# Altium schematic sheet ALL COMPONENTS.SchDoc
size A; SheetNumber: 5; SheetTotal: 6
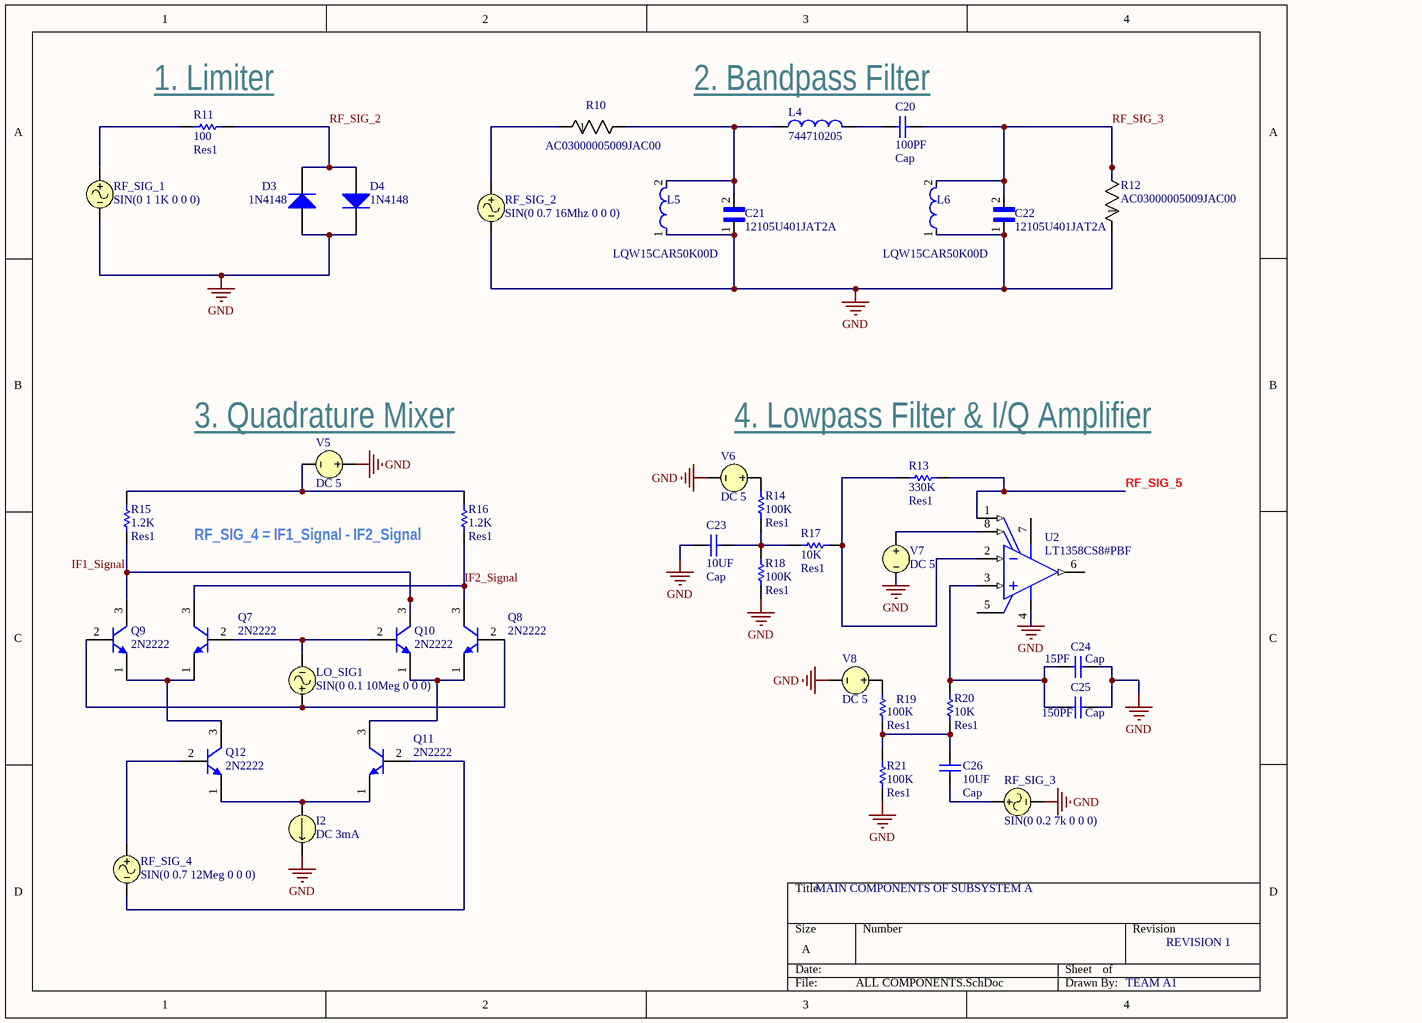
[diagram p0: ALL COMPONENTS.SchDoc]

## Parts
C20  Cap  value 100PF  [RADIAL-0.1]
C21  12105U401JAT2A  [CAPC3224X140N]
C22  12105U401JAT2A  [CAPC3224X140N]
C23  Cap  value 10UF  [RADIAL-0.1]
C24  Cap  value 15PF  [RADIAL-0.1]
C25  Cap  value 150PF  [RADIAL-0.1]
C26  Cap  value 10UF  [RADIAL-0.1]
D3  1N4148  [NXP-SOD27-2_V]
D4  1N4148  [NXP-SOD27-2_V]
I2  DC 3mA
L4  744710205  [744710205]
L5  LQW15CAR50K00D  [FP-LQW15CA_00-MFG]
L6  LQW15CAR50K00D  [FP-LQW15CA_00-MFG]
LO_SIG1  SIN(0 0.1 10Meg 0 0 0)
Q7  2N2222  [MLTC-TO-18-3]
Q8  2N2222  [MLTC-TO-18-3]
Q9  2N2222  [MLTC-TO-18-3]
Q10  2N2222  [MLTC-TO-18-3]
Q11  2N2222  [MLTC-TO-18-3]
Q12  2N2222  [MLTC-TO-18-3]
R10  AC03000005009JAC00  [RES_AC03_VIS]
R11  Res1  value 100  [AXIAL-0.1-RES]
R12  AC03000005009JAC00  [RES_AC03_VIS]
R13  Res1  value 330K  [AXIAL-0.1-RES]
R14  Res1  value 100K  [AXIAL-0.1-RES]
R15  Res1  value 1.2K  [AXIAL-0.1-RES]
R16  Res1  value 1.2K  [AXIAL-0.1-RES]
R17  Res1  value 10K  [AXIAL-0.1-RES]
R18  Res1  value 100K  [AXIAL-0.1-RES]
R19  Res1  value 100K  [AXIAL-0.1-RES]
R20  Res1  value 10K  [AXIAL-0.1-RES]
R21  Res1  value 100K  [AXIAL-0.1-RES]
RF_SIG_1  SIN(0 1 1K 0 0 0)
RF_SIG_2  SIN(0 0.7 16Mhz 0 0 0)
RF_SIG_3  SIN(0 0.2 7k 0 0 0)
RF_SIG_4  SIN(0 0.7 12Meg 0 0 0)
U2  LT1358CS8#PBF  [LT-S8-8_M]
V5  DC 5
V6  DC 5
V7  DC 5
V8  DC 5

## Nets
GND: C21.1 C22.1 C23.1 C24.2 C25.1 D3.1(A) D4.2(K) I2.2 L5.1 L6.1 R12.1 R18.1 R21.1 RF_SIG_1.2 RF_SIG_2.2 RF_SIG_3.2 U2.4(V-) V5.1 V6.2 V7.2 V8.2
IF1_Signal: Q9.3(C) Q10.3(C) R15.1
IF2_Signal: Q7.3(C) Q8.3(C) R16.1
RF_SIG_2: D3.2(K) D4.1(A) R11.2
RF_SIG_3: C20.2 C22.2 L6.2 R12.2
RF_SIG_5: R13.2 U2.1(NULL)
NetC20_1: C20.1 L4.2
NetC21_2: C21.2 L4.1 L5.2 R10.2
NetC23_2: C23.2 R14.1 R17.1 R18.2
NetC24_1: C24.1 C25.2 R20.2 U2.3(+IN)
NetC26_1: C26.1 RF_SIG_3.1
NetC26_2: C26.2 R19.1 R20.1 R21.2
NetI2_1: I2.1 Q11.1(E) Q12.1(E)
NetLO_SIG1_1: LO_SIG1.1 Q8.2(B) Q9.2(B)
NetLO_SIG1_2: LO_SIG1.2 Q7.2(B) Q10.2(B)
NetQ7_1: Q7.1(E) Q9.1(E) Q12.3(C)
NetQ8_1: Q8.1(E) Q10.1(E) Q11.3(C)
NetQ11_2: Q11.2(B) RF_SIG_4.2
NetQ12_2: Q12.2(B) RF_SIG_4.1
NetR10_1: R10.1 RF_SIG_2.1
NetR11_1: R11.1 RF_SIG_1.1
NetR13_1: R13.1 R17.2 U2.2(-IN)
NetR14_2: R14.2 V6.1
NetR15_2: R15.2 R16.2 V5.2
NetR19_2: R19.2 V8.1
NetU2_8: U2.8(NULL) V7.1

Not connected (* = marked no-connect by the designer): U2 5(NC) 6(VOUT) 7(V+)

## Notes on the sheet
- (near R11) 1. Limiter
- 2. Bandpass Filter
- (near V5) 3. Quadrature Mixer
- 4. Lowpass Filter & I/Q Amplifier
- (near R16) RF_SIG_4 = IF1_Signal - IF2_Signal
- MAIN COMPONENTS OF SUBSYSTEM A
- REVISION 1
- TEAM A1

## Library data of the parts
C20 = CAP CER 100PF 50V C0G/NP0 RADIAL: Capacitor; Manufacturer Part Number: K101K15C0GF53L2; Designator: C?; Voltage Rating: 50V; Published: 8-Jun-2000; LatestRevisionDate: 17-Jul-2002; LatestRevisionNote: Re-released for DXP Platform.; Publisher: Altium Limited
C21 C22 = 12105U401JAT2A: CAP CER 400PF 50V 5% NP0 1210; Package: None; Price: None; Value: *; MP: 12105U401JAT2A; Availability: Unavailable
C23 C26 = CAP ALUM 10UF 20% 63V RADIAL: Capacitor; Manufacturer Part Number: ESK106M063AC3FA; Designator: C?; Voltage Rating: 63V; Published: 8-Jun-2000; LatestRevisionDate: 17-Jul-2002; LatestRevisionNote: Re-released for DXP Platform.; Publisher: Altium Limited
C24 = CAP CER 15PF 50V C0G/NP0 RADIAL: Capacitor; Manufacturer Part Number: K150J15C0GF5TL2; Designator: C?; Voltage Rating: 50V; Published: 8-Jun-2000; LatestRevisionDate: 17-Jul-2002; LatestRevisionNote: Re-released for DXP Platform.; Publisher: Altium Limited
C25 = CAP CER 150PF 50V C0G/NP0 RADIAL: Capacitor; Manufacturer Part Number: K151J15C0GF53L2; Designator: C?; Voltage Rating: 50V; Published: 8-Jun-2000; LatestRevisionDate: 17-Jul-2002; LatestRevisionNote: Re-released for DXP Platform.; Publisher: Altium Limited
D3 D4 = CMP-0648-00002-1: High-speed Diode, 100 V, 450 mA, 2-Pin SOD27, RoHS; Manufacturer: NXP Semiconductors; Configuration: Single; IR (VR: 20 V)=25 nA; IFRM: 450 mA; IFSM: 4 A Max.; Trr: 4 ns Max.; Cd: 4 pF Max.; VR: 100 V Max.; VF (IF: 10 mA)=1 V; IF: 200 mA Max.; ComponentLink1Description: Manufacturer URL; RoHS: TRUE; ComponentLink1URL: http://www.nxp.com/; ComponentLink3Description: Package Specification; DatasheetVersion: Aug-04; ComponentLink2Description: Datasheet; PackageVersion: Aug-04; PackageReference: SOD27; ComponentLink3URL: http://www.nxp.com/documents/data_sheet/1N4148_1N4448.pdf; Mounting Technology: Through Hole; ComponentLink2URL: http://www.nxp.com/documents/data_sheet/1N4148_1N4448.pdf; PartNumber: 1N4148; PackageDescription: 2-Pin Hermetically Sealed Glass Package, Axial Leaded, Dia 1.85 mm, Body Length 4.25 mm, Lead Spread 25.4 mm
I2 = ISRC: Current Source; Note: PCB Footprint - Not required; AC Magnitude: 0; Published: 8-Jun-2000; LatestRevisionDate: 17-Jul-2002; LatestRevisionNote: Re-released for DXP Platform.; PackageReference: Not Applicable; Publisher: Altium Limited; AC Phase: 0; Value: 3mA
L4 = CMP-0221-00023-2: NexarPartId: 8917044; Lead Length: 9.7mm; Current Rating: 5A; Shielding: Unshielded; Core Material: Ferrite; Frequency: 100MHz; Pin Length: 3mm; Test Frequency: 10kHz; Tolerance: 25%; Resistance: 6.5MΩ; Inductance: 2µH; RoHS: Compliant; Composition: Wirewound; Ambient Temperature Range Low: -40°C; Termination: Radial; Ambient Temperature Range High: 110°C; REACH SVHC: Unknown; Width: 9.6mm; Height: 14mm; Number of Pins: 2; Length: 14mm; Lead Pitch: 9.6mm; Max Operating Temperature: 150°C; Inductance Tolerance: 25%; Mount: Through Hole; Case/Package: Radial; Max DC Current: 5A; Diameter: 4mm; Min Operating Temperature: -40°C; DC Resistance (DCR): 6.5mΩ; Self Resonant Frequency: 100MHz
L5 L6 = CMP-06042-016137-1: Wire Wound Ferrite Inductor for General Circuits 500nH ±10% 270mA 0.97Ω 0402 (1005); DC Resistance (DCR): 970mR; Test Frequency: 10MHz; Shielding: Unshielded; Self Resonant Frequency: 900MHz; RoHS Compliant: Yes; Case/Package: Nonstandard; Resistor Type: Wirewound; Height - Seated (Max): 0.026inch; Current Rating: 270mA; Width: 0.022inch; Tolerance: 10%; Min Operating Temperature: -40°C; Mount: Surface Mount; Packaging: Tape and Reel; Length: 0.04inch; Inductance: 500nH; Max Operating Temperature: 125°C; Core Material: Ferrite
LO_SIG1 = VSIN: Sinusoidal Voltage Source; Note: PCB Footprint - Not required; Offset: 0; Amplitude: 0.1; Published: 8-Jun-2000; LatestRevisionDate: 15-Nov-2004; LatestRevisionNote: Corrected Netlist.; PackageReference: Not Applicable; Publisher: Altium Limited; Frequency: 10Meg; Delay: 0; Damping Factor: 0; Phase: 0; DC Magnitude: 0; AC Magnitude: 0; AC Phase: 0
Q7-Q12 = CMP-2000-05237-1: Low Power Bipolar NPN Transistor, 30 V, -65 to 200 degC, 3-Pin TO-18, RoHS, Bulk; Manufacturer: Multicomp; Pin Configuration: a; No. of Pins: 3; No. of Transistors: 1; Collector Emitter Voltage Vces: 400mV; Current Ic Continuous a Max: 800mA; Power Dissipation Pd: 500mW; Collector Emitter Voltage V(br)ceo: 30V; Gain Bandwidth ft Typ: 250MHz; Voltage Vcbo: 60V; DC Current Gain hFE: 100; Full Power Rating Temperature: 25degC; Current Ic @ Vce Sat: 150mA; SVHC: NoSVHC(19-Dec-2012); Package Reference: TO-18-3; Package Description: 3-Pin Transistor Outline Package (TO-18), Dia 5.54 mm, Pitch Pitch 1.485mm; Datasheet URL: http://www.farnell.com/datasheets/1662272.pdf; Transistor Case Style: TO-18; Continuous Collector Current Ic Max: 800mA; Manufacturer URL: http://uk.farnell.com/b/multicomp; DC Collector Current: 800mA; Hfe Min: 100; Transistor Polarity: NPN; Power Dissipation Ptot Max: 500mW; Package / Case: TO-18; Datasheet Version: Rev. 1.1, 05/2012; Gain Bandwidth ft Min: 250MHz; Current Ic hFE: 150mA
R10 R12 = CMP-00030-39746332-1: AC03000005009JAC00 Res Wirewound 50 Ohm 5% 3W -80ppm/°C to -10ppm/°C Conformal AXL Thru-Hole Ammo Pack; Voltage Rating: 12V; Lead Diameter: 800µm; Resistance: 50Ω; Number of Terminations: 2; Features: Flame Retardant Coating; Number of Pins: 2; Termination: Axial; Diameter: 4.8mm; Packaging: Tape & Box (TB); REACH SVHC: Unknown; Min Operating Temperature: -40°C; Contact Plating: Tin; Length: 13mm; Thickness: 4.8006mm; Power Rating: 3W; Schedule B: 8533210080, 8533210080; Temperature Coefficient: -80ppm/°C; Tolerance: 5%; RoHS: Compliant; Radiation Hardening: No; Voltage Rating (DC): 12V; Width: 4.8mm; Max Power Dissipation: 3W; Case/Package: Axial; Composition: Wirewound; Max Operating Temperature: 275°C; NexarPartId: 39746332
R11 = RES 100 OHM 5% 1/4W AXIAL: Resistor; Manufacturer Part Number: CFR-25JB-52-100R; Designator: R?; Power Rating: 1/4W; Tolerance: 0.05; Published: 8-Jun-2000; LatestRevisionDate: 17-Jul-2002; LatestRevisionNote: Re-released for DXP Platform.; Publisher: Altium Limited
R13 = RES 330K OHM 5% 1/4W AXIAL: Resistor; Manufacturer Part Number: CFR-25JB-52-330K; Designator: R?; Power Rating: 1/4W; Tolerance: 0.05; Published: 8-Jun-2000; LatestRevisionDate: 17-Jul-2002; LatestRevisionNote: Re-released for DXP Platform.; Publisher: Altium Limited
R14 R18 R19 R21 = RES 100K OHM 5% 1/4W AXIAL: Resistor; Manufacturer Part Number: CFR-25JB-52-100K; Designator: R?; Power Rating: 1/4W; Tolerance: 0.05; Published: 8-Jun-2000; LatestRevisionDate: 17-Jul-2002; LatestRevisionNote: Re-released for DXP Platform.; Publisher: Altium Limited
R15 R16 = RES 1.2K OHM 5% 1/4W AXIAL: Resistor; Manufacturer Part Number: CFR-25JB-52-1K2; Designator: R?; Power Rating: 1/4W; Tolerance: 0.05; Published: 8-Jun-2000; LatestRevisionDate: 17-Jul-2002; LatestRevisionNote: Re-released for DXP Platform.; Publisher: Altium Limited
R17 R20 = RES 10K OHM 5% 1/4W AXIAL: Resistor; Manufacturer Part Number: CFR-25JB-52-10K; Designator: R?; Power Rating: 1/4W; Tolerance: 0.05; Published: 8-Jun-2000; LatestRevisionDate: 17-Jul-2002; LatestRevisionNote: Re-released for DXP Platform.; Publisher: Altium Limited
RF_SIG_1 = VSIN: Sinusoidal Voltage Source; Note: PCB Footprint - Not required; Offset: 0; Amplitude: 1; Published: 8-Jun-2000; LatestRevisionDate: 15-Nov-2004; LatestRevisionNote: Corrected Netlist.; PackageReference: Not Applicable; Publisher: Altium Limited; Frequency: 1K; Delay: 0; Damping Factor: 0; Phase: 0; DC Magnitude: 0; AC Magnitude: 1; AC Phase: 0
RF_SIG_2 = VSIN: Sinusoidal Voltage Source; Note: PCB Footprint - Not required; Offset: 0; Amplitude: 0.7; AC Magnitude: 1; Published: 8-Jun-2000; LatestRevisionDate: 15-Nov-2004; LatestRevisionNote: Corrected Netlist.; PackageReference: Not Applicable; Publisher: Altium Limited; Frequency: 16Mhz; Delay: 0; Damping Factor: 0; Phase: 0; DC Magnitude: 0; AC Phase: 0
RF_SIG_3 = VSIN: Sinusoidal Voltage Source; Note: PCB Footprint - Not required; Offset: 0; Amplitude: 0.2; AC Magnitude: 1; Published: 8-Jun-2000; LatestRevisionDate: 15-Nov-2004; LatestRevisionNote: Corrected Netlist.; PackageReference: Not Applicable; Publisher: Altium Limited; Frequency: 7k; Delay: 0; Damping Factor: 0; Phase: 0; DC Magnitude: 0; AC Phase: 0
RF_SIG_4 = VSIN: Sinusoidal Voltage Source; Note: PCB Footprint - Not required; Offset: 0; Amplitude: 0.7; Published: 8-Jun-2000; LatestRevisionDate: 15-Nov-2004; LatestRevisionNote: Corrected Netlist.; PackageReference: Not Applicable; Publisher: Altium Limited; Frequency: 12Meg; Delay: 0; Damping Factor: 0; Phase: 0; DC Magnitude: 0; AC Magnitude: 0; AC Phase: 0
U2 = CMP-0359-02713-2: Dual Channel, High Speed Precision Operational Amplifier, 25 MHz Typical GBW, 600 V/us Typical SR, 5 to 36 V, 8-Pin SOIC (S8-8), Commerical, Pb-Free; Manufacturer: Linear Technology; Linear Technology Part Number: LT1358; Vos (mV) Typical: 0.2; Vs Min (V): 5; Channels (#): 2; SR (V/us) Typical: 600; GBW (MHz) Typical: 25; Vs Max (V): 36; Mounting Technology: Surface Mount; ComponentLink3URL: http://cds.linear.com/docs/en/packaging/05081610_G_SO8.pdf; ComponentLink2URL: http://cds.linear.com/docs/en/datasheet/135859fb.pdf; Is (mA) Typical: 2; DatasheetVersion: Rev. B; ComponentLink1URL: http://www.linear.com/; Type: VFB; RoHS: Pb-Free; ComponentLink3Description: Package Specification; ComponentLink1Description: Manufacturer URL; RevisionNote: URLs updated; PackageReference: LT-S8-8; PackageVersion: Rev G; PartNumber: LT1358CS8#PBF; PackageDescription: 8-Pin Plastic Small Outline, Body 4.9 x 3.9 mm, Pitch 1.27 mm; ComponentLink2Description: Datasheet
V5 = VSRC: Voltage Source; Note: PCB Footprint - Not required; AC Magnitude: 0; Value: 5; Published: 8-Jun-2000; LatestRevisionDate: 17-Jul-2002; LatestRevisionNote: Re-released for DXP Platform.; PackageReference: Not Applicable; Publisher: Altium Limited; AC Phase: 0
V6-V8 = VSRC: Voltage Source; Note: PCB Footprint - Not required; AC Magnitude: 1; AC Phase: 0; Value: 5; Published: 8-Jun-2000; LatestRevisionDate: 17-Jul-2002; LatestRevisionNote: Re-released for DXP Platform.; PackageReference: Not Applicable; Publisher: Altium Limited